# EAGLE design hangszóró (EAGLE 6.5.0)
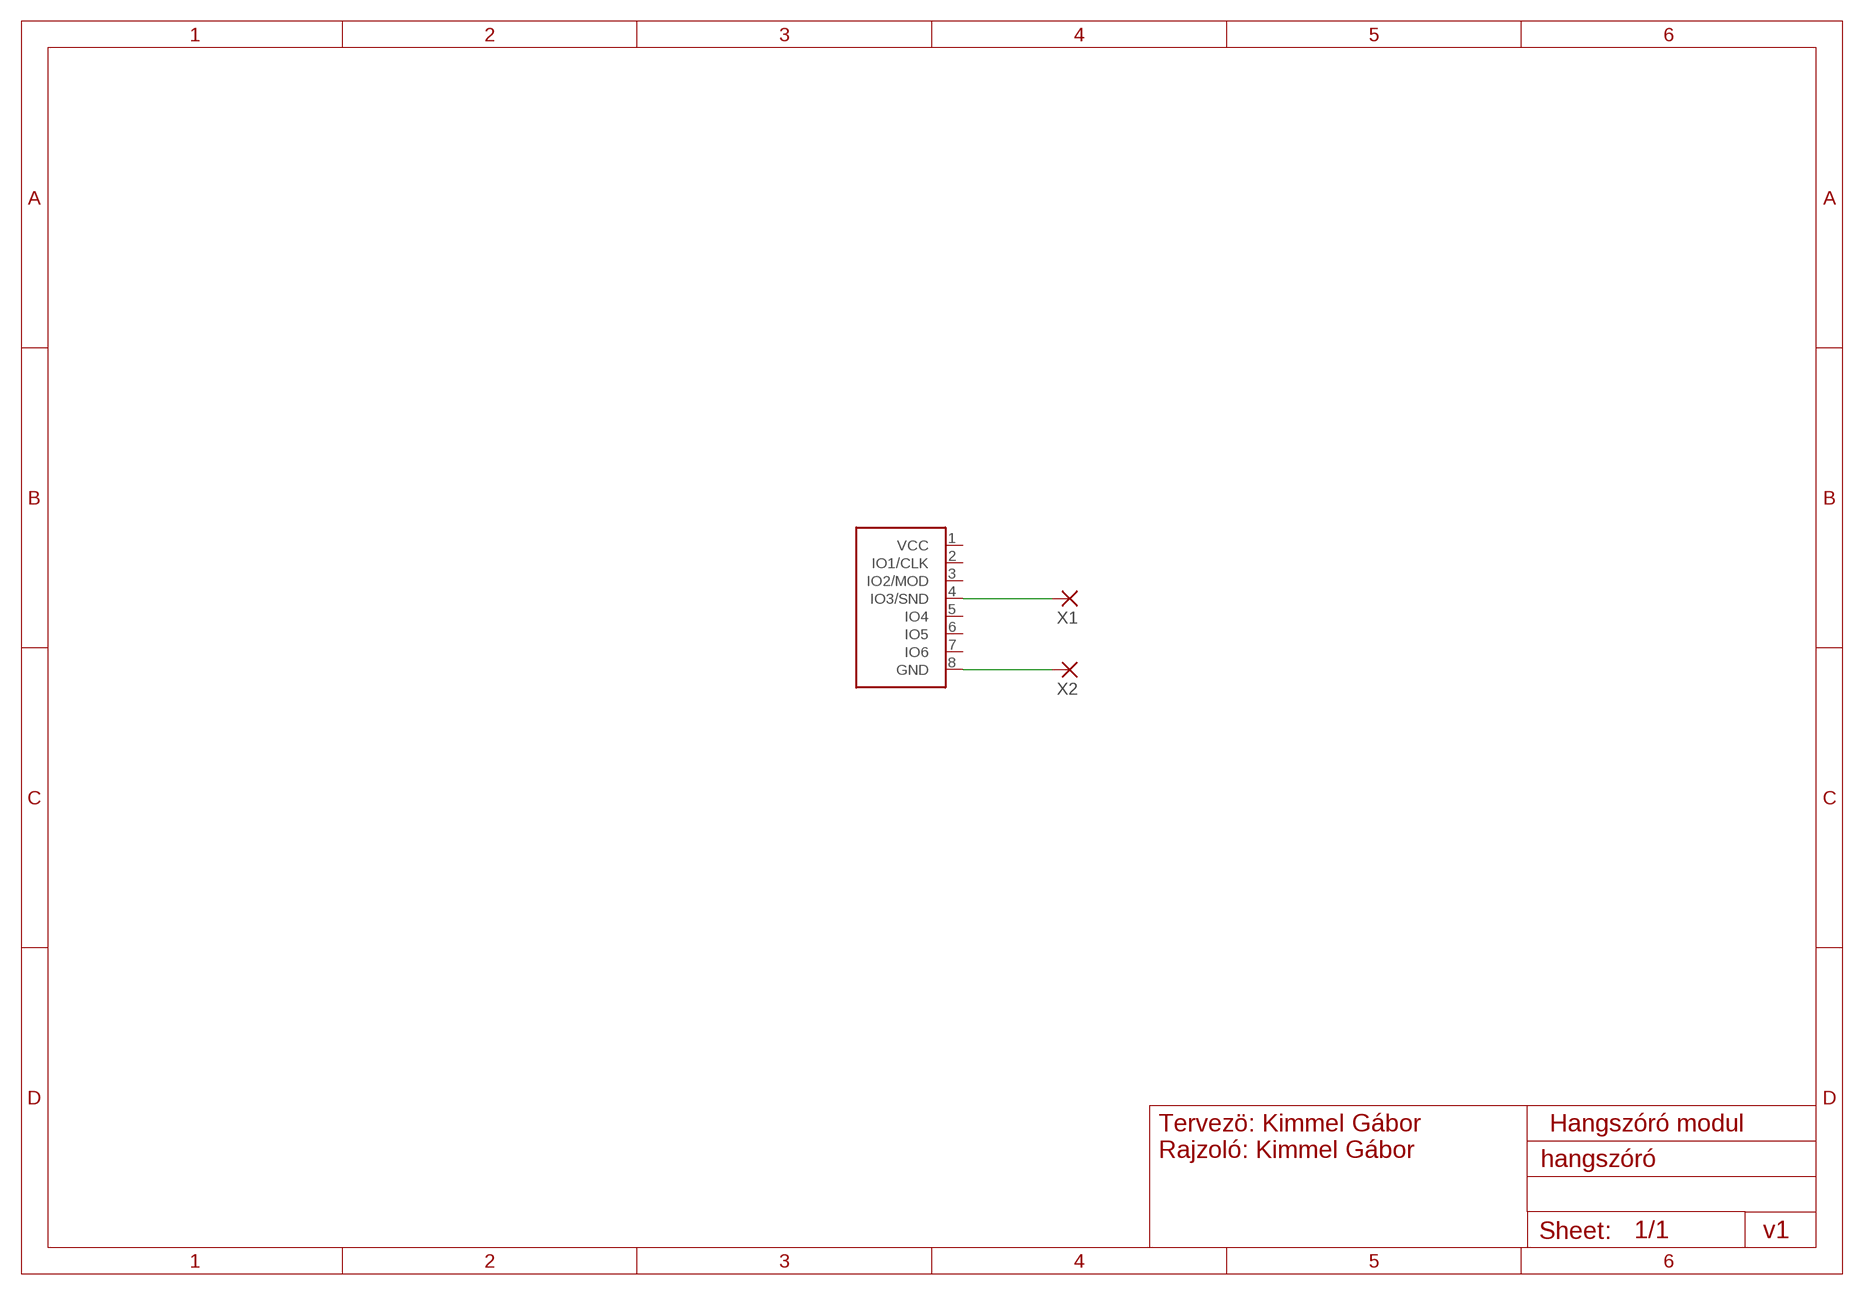
[diagram p0: schematic, sheet 1]

## Parts
U$1  GANZ-CONNECTOR  [FE08W]
X1  2,15/1,0  [2,15/1,0]
X2  2,15/1,0  [2,15/1,0]

## Nets
N$1: U$1.4(IO3/SND) X1.1(P)
N$3: U$1.8(GND) X2.1(P)
Unconnected: U$1.1(VCC) U$1.2(IO1/CLK) U$1.3(IO2/MOD) U$1.5(IO4) U$1.6(IO5) U$1.7(IO6)

## Notes on the sheet
- Tervezö: Kimmel Gábor
  Rajzoló: Kimmel Gábor
- Hangszóró modul
- v1

## Library data of the parts
U$1 = ganzlib:GANZ-CONNECTOR
X1 X2 = wirepad:2,15/1,0: THROUGH-HOLE PAD

## Board
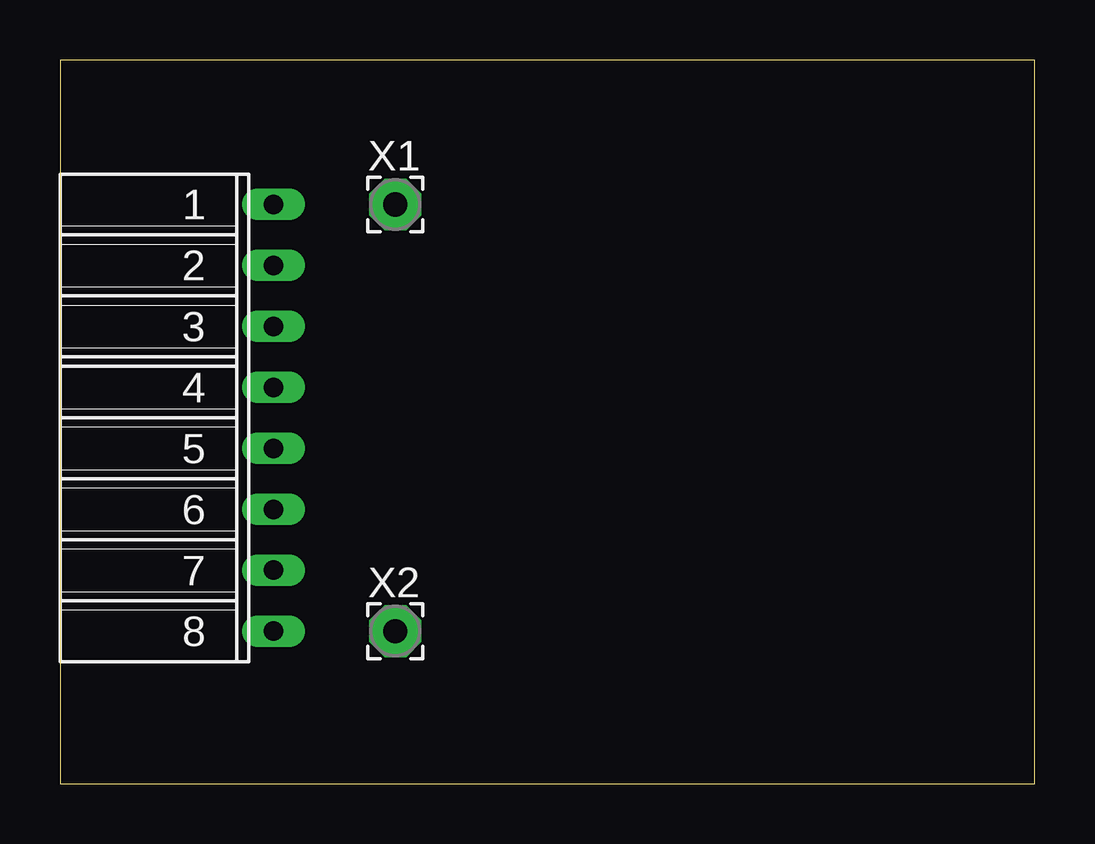
[diagram p1: board, top side]
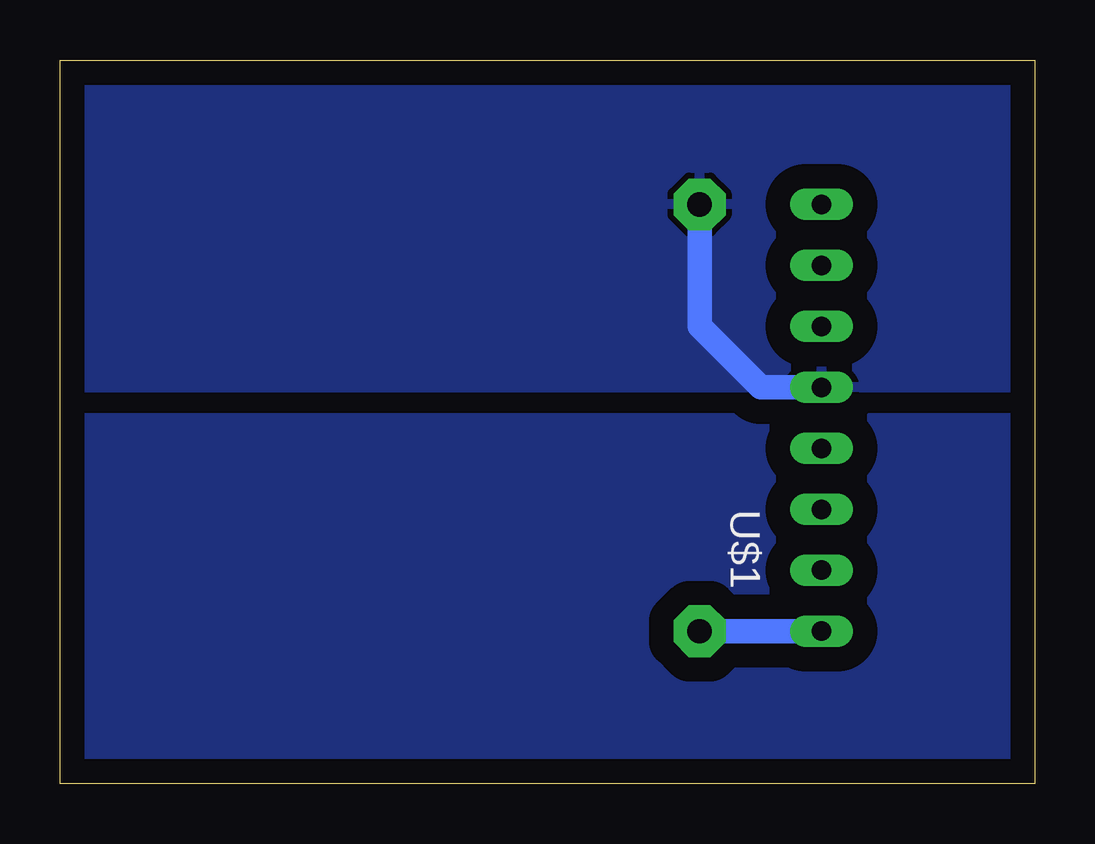
[diagram p2: board, bottom side, seen from below]

Size 40.62 x 30.15 mm. Coordinates in mm from the lower left corner, seen from the top.
Outline: 0,0 40.62,0 40.62,30.15 0,30.15 0,0
Copper layers (1*16): Top 0.035mm / dielectric 1.5mm / Bottom 0.035mm
Design rules "default": minimum track width 10mil, minimum drill 24mil, track to track 8mil, track to pad 8mil, pad to pad 8mil, via to via 8mil, smd to smd 8mil, copper to edge 40mil, drill to drill 8mil, minimum pad ring 10mil, minimum via ring 8mil, stop-mask expansion 4mil, vias tented up to drill 0mil, thermal gap 10mil

### Footprints (pad centres in the part's own frame; a part is rotated, then mirrored left to right if it is on the bottom)
FE08W = drill 0.813 long: 1 5.08,8.89; 2 5.08,6.35; 3 5.08,3.81; 4 5.08,1.27; 5 5.08,-1.27; 6 5.08,-3.81; 7 5.08,-6.35; 8 5.08,-8.89
2,15/1,0 = drill 1.016 pad 2.159 octagon: 1 0,0

### Placement (x,y rotation side)
U$1  3.81,15.24 0 top
X1  13.97,24.13 0 top
X2  13.97,6.35 0 top

### Tracks (layer width: path | path; a pad name or v marks a point on that pad's centre or on a via)
N$1
  Bottom 1.016: U$1.4 11.43,16.51 13.97,19.05 X1.1
  pour Bottom (isolate 1.016): 0,30.48 40.64,30.48 40.64,16.51 0,16.51
N$2
  pour Bottom (isolate 1.016): 0,0 40.64,0 40.64,15.24 0,15.24
N$3
  Bottom 1.016: U$1.8 X2.1